# Altium schematic sheet audio_amplifier.SchDoc
size A4
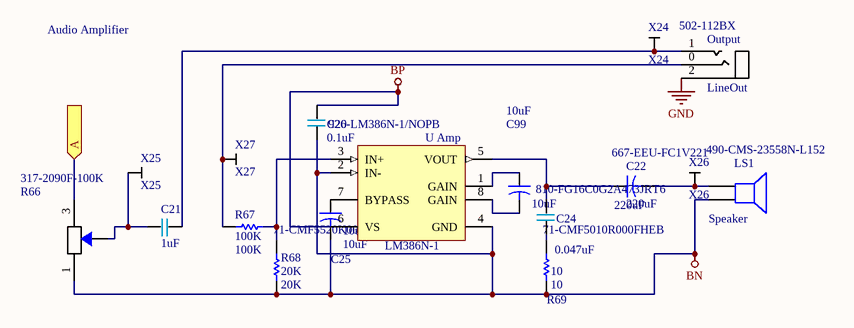
[diagram p0: audio_amplifier.SchDoc]

## Parts
C20  value 0.1uF  [Cap Film 5]  (hidden comment: .1uF)
C21  1uF  [Cap Film 5]
C22  220uF  Supplier Part Number 1: 667-EEU-FC1V221  [CAPR5-4X5]
C24  value 0.047uF  Supplier Part Number 1: 810-FG16C0G2A473JRT6  [Cap Film 5]  (hidden comment: Cap Film 5)
C25  10uF  [CAPR5-4X5]
C99  10uF  [CAPR5-4X5]
LS1  Speaker  Supplier Part Number 1: 490-CMS-23558N-L152  [PIN2]
Output  LineOut  Supplier Part Number 1: 502-112BX  [Stereo Jack]
R66  Supplier Part Number 1: 317-2090F-100K  [Potentiometer]  (hidden comment: 100K)
R67  100K  [AXIAL-0.3]
R68  20K  Supplier Part Number 1: 71-CMF5520K000FHEB  [AXIAL-0.3]
R69  10  Supplier Part Number 1: 71-CMF5010R000FHEB  [AXIAL-0.3]
U_Amp  LM386N-1  Supplier Part Number 1: 926-LM386N-1/NOPB  [N08E]
X24  X24  [Pad]
X25  X25  [Pad]
X26  X26  [Pad]
X27  X27  [Pad]

## Ports
A (in)

## Nets
BN: C20.1 C25.2 LS1.2 R66.1 R68.1 R69.1 U_Amp.2(IN-) U_Amp.4(GND)
BP: C20.2 U_Amp.6(VS)
GND: Output.2(Sleeve)
A: R66.3 ; port A
NetC21_1: C21.1 Output.1(Tip) X24.1
NetC21_2: C21.2 R66.2 X25.1
NetC22_1: C22.1 C24.2 U_Amp.5(VOUT)
NetC22_2: C22.2 LS1.1 X26.1
NetC24_1: C24.1 R69.2
NetC25_1: C25.1 U_Amp.7(BYPASS)
NetC99_1: C99.1 U_Amp.1(GAIN)
NetC99_2: C99.2 U_Amp.8(GAIN)
NetOutput_0: Output.0(Ring) R67.1 X27.1
NetR67_2: R67.2 R68.2 U_Amp.3(IN+)

## Notes on the sheet
- Audio Amplifier

## Library data of the parts
C20 = Cap Film 5: Supplier 1: Mouser; Supplier Part Number 1: 594-K104K20X7RH53K2
C21 = Cap Film 5: Manufacturer: Panasonic; Manufacturer Part Number: ECQ-E2105KF; Value: 1uF; Supplier 1: Mouser; Supplier Part Number 1: 667-ECQ-E2105KF
C22 = Cap2: Capacitor; Manufacturer: Panasonic; Manufacturer Part Number: EEU-FC1V221; Tolerance: 20 %; Type: Radial Lead Type; Voltage Rating DC: 35 VDC; ESR: 90 mOhms; Life: 3000 Hour; Ripple Current: 755 mA; Published: 23-Sep-2002; PackageReference: CAPR5-4X5; Publisher: Altium Limited; PackageDescription: Capacitor; 2 Leads; Value: 220uF; Supplier 1: Mouser; RoHS: RoHS Compliant; Category: Aluminum Electrolytic Capacitors - Leaded; Stock 1: 11676; Pricing 1: 1=0.540, 10=0.290, 100=0.215, 500=0.187, 1000=0.159, 2500=0.150, 10000=0.129, 25000=0.127, 50000=0.120 (USD); Capacitance: 220 uF; Diameter: 10 mm; Length: 12.5 mm; Packaging: Bulk; Product: High Temp Electrolytic Capacitors; Series: FC; Termination Style: Radial; Brand: Panasonic; Lead Spacing: 5 mm; Maximum Operating Temperature: + 105 C; Minimum Operating Temperature: - 55 C; Standard Pack Qty: 200; RoHS - Mouser: Y; Minimum Order Quantity: 1; Reeling: False; ComponentLink1URL: http://www.mouser.com/ds/2/315/ABA0000CE22-68457.pdf; ComponentLink1Description: http://www.mouser.com/ds/2/315/ABA0000CE22-68457.pdf
C24 = Cap Film 5: Manufacturer: TDK; Manufacturer Part Number: FG16C0G2A473JRT06; Capacitance: 0.047 uF; Tolerance: 5 %; Type: Dipped Radial Multilayer Ceramic Capacitors; Voltage Rating: 100 V; Voltage Rating DC: 100 VDC; Case Style: Dipped; Capacitance - nF: 47 nF; Capacitance - pF: 47000 pF; Class: Class 1; Dielectric: C0G (NP0); Product Status: New Product; Supplier 1: Mouser; RoHS: RoHS Compliant; Category: Multilayer Ceramic Capacitors MLCC - Leaded; Stock 1: 3902; Pricing 1: 1=0.980, 10=0.832, 100=0.408, 500=0.368, 1000=0.337, 2000=0.219, 10000=0.208, 24000=0.204, 50000=0.199 (USD); Height: 3.5 mm; Length: 5.5 mm; Operating Temperature Range: - 55 C to + 125 C; Packaging: Reel; Product: General Type MLCCs; Series: FG; Termination Style: Radial; Width: 6 mm; Brand: TDK; Lead Spacing: 2.5 mm; Lead Style: Inside Bend; Maximum Operating Temperature: + 125 C; Minimum Operating Temperature: - 55 C; Standard Pack Qty: 2000; RoHS - Mouser: Y; Minimum Order Quantity: 1; Reeling: True; ComponentLink1URL: http://www.mouser.com/ds/2/400/eadmlcc_halogenfree_fg_en-775693.pdf; ComponentLink1Description: http://www.mouser.com/ds/2/400/eadmlcc_halogenfree_fg_en-775693.pdf
C25 C99 = Cap2: Capacitor; Manufacturer Part Number: ECA-1VM100; Brand: Panasonic; Life: 2000 Hour; Ripple Current: 60 mA; Tolerance: 20 %; Type: Radial Lead Type; Voltage Rating DC: 35 VDC; Published: 23-Sep-2002; PackageReference: CAPR5-4X5; Publisher: Altium Limited; PackageDescription: Capacitor; 2 Leads; Value: 10uF; Capacitance: 10 uF; Category: Aluminum Electrolytic Capacitors - Leaded; ComponentLink1Description: http://www.mouser.com/ds/2/315/ABA0000C1047-947484.pdf; ComponentLink1URL: http://www.mouser.com/ds/2/315/ABA0000C1047-947484.pdf; Diameter: 5 mm; Lead Spacing: 2 mm; Lead Style: Straight; Length: 11 mm; Manufacturer: Panasonic; Maximum Operating Temperature: + 85 C; Minimum Operating Temperature: - 40 C; Minimum Order Quantity: 1; Package / Case: Radial, Can; Packaging: Bulk; Pricing 1: 1=0.200, 10=0.080, 100=0.055, 500=0.046, 1000=0.041, 2500=0.039, 10000=0.030, 25000=0.028, 50000=0.025 (USD); Product: General Purpose Electrolytic Capacitors; Reeling: False; RoHS - Mouser: Y; RoHS: RoHS Compliant; Series: M; Standard Pack Qty: 200; Stock 1: 30530; Supplier 1: Mouser; Supplier Part Number 1: 667-ECA-1VM100; Termination Style: Radial
LS1 = Speaker: Loudspeaker; Manufacturer: CUI; Manufacturer Part Number: CMS-23558N-L152; Frequency: 550 Hz; Impedance: 8 Ohms; Power Rating: 1 W; Sound Pressure Level: 94 dB; Voltage Rating: 2.83 V; Cone Material: Mylar; Magnet Material: Neodymium Iron Boron (NdFeB); Shape: Round; Product Status: New Product; Published: 24-Mar-1999; LatestRevisionDate: 17-Jul-2002; LatestRevisionNote: Re-released for DXP Platform.; PackageReference: PIN2; Publisher: Altium Limited; Supplier 1: Mouser; RoHS: RoHS Compliant; Category: Speakers & Transducers; Stock 1: 983; Pricing 1: 1=3.42, 10=3.07, 50=2.39, 100=2.30, 200=2.22, 500=2.13, 1000=2.09 (USD); Depth: 5.5 mm; Diameter: 23 mm; Operating Temperature Range: - 20 C to + 55 C; Packaging: Tray; Product: Speakers; Series: CMS; Termination Style: Wire Leads; Type: Speaker; Brand: CUI; Standard Pack Qty: 100; RoHS - Mouser: Y; Minimum Order Quantity: 1; Reeling: False; ComponentLink1URL: http://www.mouser.com/ds/2/670/cms-23558n-l152-959413.pdf; ComponentLink1Description: http://www.mouser.com/ds/2/670/cms-23558n-l152-959413.pdf
Output = Stereo Jack: Manufacturer: Switchcraft; Manufacturer Part Number: 112BX; Gender: Female; Switch Configuration: Switched; Supplier 1: Mouser; RoHS: RoHS Compliant; Category: Phone Connectors; Stock 1: 11587; Pricing 1: 1=3.28, 10=2.46, 25=2.25, 50=2.16, 100=2.05, 250=1.84, 500=1.55, 1000=1.43, 2500=1.40 (USD); Color: Black; Contact Plating: Nickel; Packaging: Bulk; Series: Hi-D Jax; Termination Style: Solder; Brand: Switchcraft; Contact Material: Copper Alloy; Mounting Style: Chassis (Panel); Standard: 1/4 in; Standard Pack Qty: 500; Tradename: Hi-D Jax; RoHS - Mouser: Y; Minimum Order Quantity: 1; Reeling: False; ComponentLink1URL: http://www.mouser.com/ds/2/393/110x-m110x_series_cd-318788.pdf; ComponentLink1Description: http://www.mouser.com/ds/2/393/110x-m110x_series_cd-318788.pdf
R66 = Potentiometer: My Own; Manufacturer: Alpha (Taiwan); Manufacturer Part Number: RV09AF-40-20K-B100K; Power Rating: 100 mW; Resistance: 100 kOhms; Tolerance: 20 %; Voltage Rating: 50 V; Number of Gangs: 1 Gang; Number of Turns: 1 Turn; Shaft Diameter: 6 mm; Shaft Length: 20 mm; Shaft Type: Knurled / Serrated; Supplier 1: Mouser; RoHS: RoHS Compliant; Category: Potentiometers; Stock 1: 13035; Pricing 1: 1=1.32, 25=1.11, 50=1.03, 100=0.940, 500=0.790, 1000=0.660, 2500=0.550, 5000=0.500, 10000=0.450 (USD); Operating Temperature Range: - 10 C to + 70 C; Product: Potentiometer; Termination Style: Through Hole; Type: Rotary; Brand: Alpha (Taiwan); Mounting Style: Panel Mount; Standard Pack Qty: 1000; Taper: Linear; RoHS - Mouser: Y; Minimum Order Quantity: 1; Reeling: False; Value: 100K
R67 = Res1: Resistor; Manufacturer Part Number: CMF55100K00FHEK; Brand: Vishay / Dale; Lead Diameter: 0.64 mm; Power Rating: 500 mW (1/2 W); Resistance: 100 kOhms; Temperature Coefficient: 50 PPM / C; Tolerance: 1 %; Voltage Rating: 250 V; Published: 8-Jun-2000; LatestRevisionDate: 17-Jul-2002; LatestRevisionNote: Re-released for DXP Platform.; PackageReference: AXIAL-0.3; Publisher: Altium Limited; PackageDescription: Axial Device, Thru-Hole; 2 Leads; 0.3 in Pin Spacing; Value: 100K; Category: Metal Film Resistors - Through Hole; ComponentLink1Description: http://www.mouser.com/ds/2/427/cmfind-239942.pdf; ComponentLink1URL: http://www.mouser.com/ds/2/427/cmfind-239942.pdf; Diameter: 2.29 mm; Length: 6.1 mm; Manufacturer: Vishay / Dale; Minimum Order Quantity: 1; Operating Temperature Range: - 55 C to + 175 C; Packaging: Bulk; Pricing 1: 1=0.230, 25=0.181, 100=0.132, 500=0.115, 1000=0.099, 2000=0.092, 5000=0.087, 10000=0.082, 25000=0.072 (USD); Product: Metal Film Resistors Controlled Temp Coefficient; Reeling: False; RoHS - Mouser: Y; RoHS: RoHS Compliant; Series: CMF Industrial; Standard Pack Qty: 100; Stock 1: 4041; Supplier 1: Mouser; Supplier Part Number 1: 71-CMF55100K00FHEK; Termination Style: Axial; Type: Metal Film Resistors, Industrial, Precision; Supplier Part Number 2: 71-CMF50100K00FHEB
R68 = Res1: Resistor; Manufacturer: Vishay / Dale; Manufacturer Part Number: CMF5520K000FHEB; Power Rating: 500 mW (1/2 W); Resistance: 20 kOhms; Temperature Coefficient: 50 PPM / C; Tolerance: 1 %; Voltage Rating: 250 V; Lead Diameter: 0.64 mm; Published: 8-Jun-2000; LatestRevisionDate: 17-Jul-2002; LatestRevisionNote: Re-released for DXP Platform.; PackageReference: AXIAL-0.3; Publisher: Altium Limited; PackageDescription: Axial Device, Thru-Hole; 2 Leads; 0.3 in Pin Spacing; Value: 20K; Supplier 1: Mouser; RoHS: RoHS Compliant; Category: Metal Film Resistors - Through Hole; Stock 1: 2368; Pricing 1: 1=0.350, 50=0.266, 100=0.168, 500=0.144, 1000=0.100, 2000=0.093, 5000=0.084, 10000=0.082, 25000=0.080 (USD); Diameter: 2.29 mm; Length: 6.1 mm; Operating Temperature Range: - 55 C to + 175 C; Packaging: Reel; Product: Metal Film Resistors Controlled Temp Coefficient; Series: CMF Industrial; Termination Style: Axial; Type: Metal Film Resistors, Industrial, Precision; Brand: Vishay / Dale; Standard Pack Qty: 1000; RoHS - Mouser: Y; Minimum Order Quantity: 1; Reeling: True; ComponentLink1URL: http://www.mouser.com/ds/2/427/cmfind-239942.pdf; ComponentLink1Description: http://www.mouser.com/ds/2/427/cmfind-239942.pdf
R69 = Res1: Metal Film Resistors - Through Hole 1/4watt 10Kohms 5% Rated to 1/2watt; Manufacturer: Vishay / Dale; Manufacturer Part Number: CMF5010R000FHEB; Power Rating: 250 mW (1/4 W); Resistance: 10 Ohms; Temperature Coefficient: 50 PPM / C; Tolerance: 1 %; Voltage Rating: 200 V; Lead Diameter: 0.41 mm; Published: 8-Jun-2000; LatestRevisionDate: 17-Jul-2002; LatestRevisionNote: Re-released for DXP Platform.; PackageReference: AXIAL-0.3; Publisher: Altium Limited; PackageDescription: Axial Device, Thru-Hole; 2 Leads; 0.3 in Pin Spacing; Value: 10; Supplier 1: Mouser; RoHS: RoHS Compliant; Category: Metal Film Resistors - Through Hole; Stock 1: 755; Pricing 1: 1=0.390, 10=0.330, 50=0.270, 100=0.240, 500=0.218, 1000=0.194, 2000=0.188, 5000=0.182, 10000=0.175 (USD); Diameter: 1.65 mm; Length: 3.81 mm; Operating Temperature Range: - 55 C to + 175 C; Packaging: Reel; Product: Metal Film Resistors Controlled Temp Coefficient; Series: CMF Industrial; Termination Style: Axial; Type: Metal Film Resistors, Industrial, Precision; Brand: Vishay / Dale; Standard Pack Qty: 1000; RoHS - Mouser: Y; Minimum Order Quantity: 1; Reeling: True; ComponentLink1URL: http://www.mouser.com/ds/2/427/cmfind-239942.pdf; ComponentLink1Description: http://www.mouser.com/ds/2/427/cmfind-239942.pdf
U_Amp = LM386N-1: Low Voltage Audio Power Amplifier, 8-pin MDIP; Manufacturer: National Semiconductor; Manufacturer Part Number: LM386N-1/NOPB; PackageTopMarking: NSUZXYTTE#*LM*386N-1; PowerWise: N; CompType: Audio IC; High-Reliability: Y; Input Type: Analog; Output Power: 325 mW; Audio - Load Impedance: 4 ohm; Brand: Texas Instruments; Gain: 20 dB; Number of Channels: 1 Channel; Class: Class-AB; Operating Supply Current: 4 mA; Operating Supply Voltage: 4 V to 12 V; Pd - Power Dissipation: 1.25 W; PSRR - Power Supply Rejection Ratio: 50 dB; Supply Voltage - Max: 18 V; Supply Voltage - Min: 4 V; DatasheetVersion: Aug-2000; PackageVersion: revG, May-2006; PackageReference: N08E; PackageDescription: MDIP, .365 x .250 x .130in, 8 Lead, .100in Pitch; PartNumber: LM386N-1; RoHS: N; PinCount: 8; Code_JEDEC: MS-001-BA; ComponentLink1Description: Manufacturer URL; ComponentLink1URL: http://www.national.com/; ComponentLink2Description: LM386 Datasheet; ComponentLink2URL: http://www.national.com/ds/LM/LM386.pdf; ComponentLink3Description: LM386 Web Page; ComponentLink3URL: http://www.national.com/pf/LM/LM386.html; ComponentLink4Description: N08E Package Page; ComponentLink4URL: http://www.national.com/packaging/folders/n08e.html; Supplier 1: Mouser; Category: Audio Amplifiers; Stock 1: 14339; Pricing 1: 1=0.970, 10=0.829, 100=0.636, 500=0.562, 1000=0.444, 2500=0.394, 10000=0.379, 25000=0.367 (USD); Package / Case: PDIP-8; Packaging: Tube; Product: Audio Amplifiers; Series: LM386; Type: 1-Channel Mono; Mounting Style: Through Hole; THD plus Noise: -; Maximum Operating Temperature: + 70 C; Minimum Operating Temperature: 0 C; Standard Pack Qty: 40; RoHS - Mouser: Y; Minimum Order Quantity: 1; Reeling: False
X24-X27 = Pad